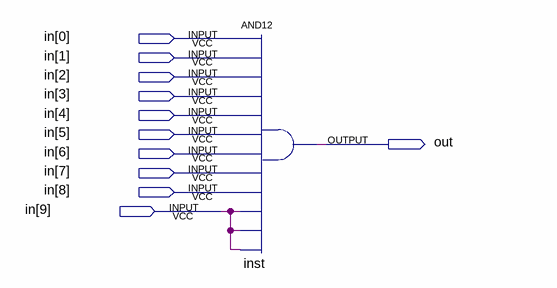
[diagram p0: schematic sheet]
// Quartus schematic and10.bdf as structural Verilog: 1 symbols, 11 pins
module and10 (
  input  [9:0] in,
  output out
);

  and inst (out, in[0], in[1], in[2], in[3], in[4], in[5], in[6], in[7], in[8], in[9], in[9], in[9]);
endmodule
